# Altium schematic sheet Nucleo.SchDoc
size A3; SheetNumber: 3; SheetTotal: 15
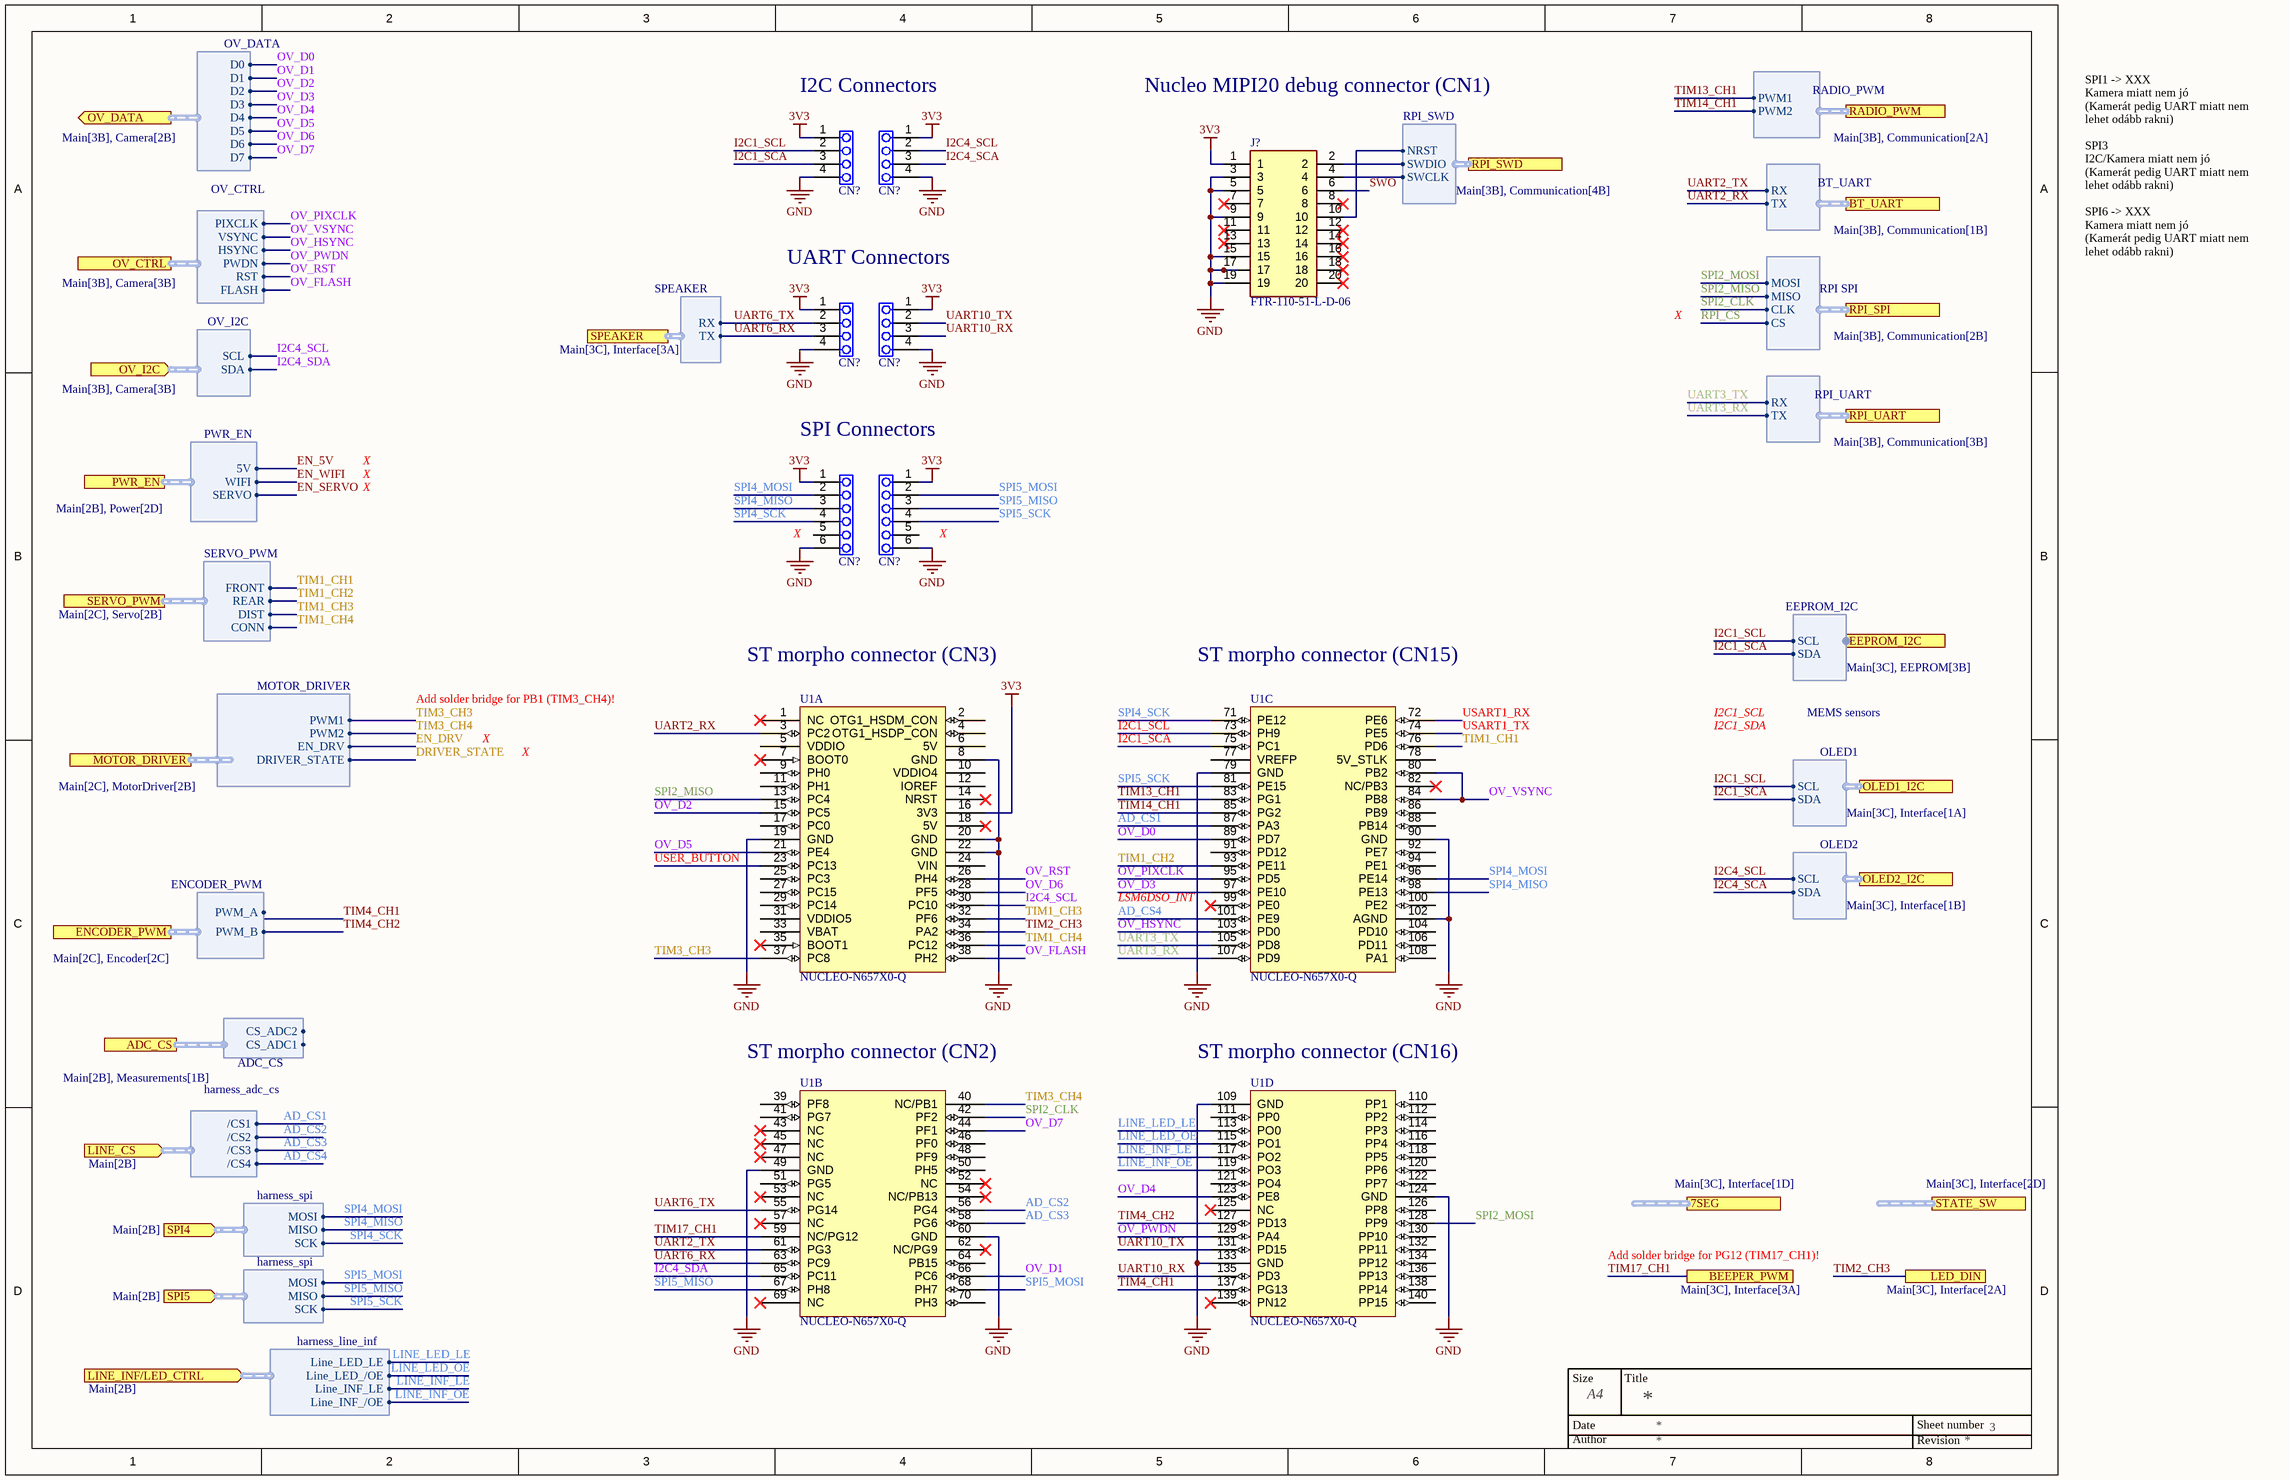
[diagram p0: Nucleo.SchDoc]

## Parts
(Parts that share a designator on the sheet are numbered #1, #2 ... from top to bottom, then left to right.)
CN?#1  Pins 1x3  [PIN-1X4]  (value not drawn)
CN?#2  Pins 1x3  [PIN-1X4]  (value not drawn)
CN?#3  Pins 1x3  [PIN-1X4]  (value not drawn)
CN?#4  Pins 1x3  [PIN-1X4]  (value not drawn)
CN?#5  Pins 1x3  [PIN-1X6]  (value not drawn)
CN?#6  Pins 1x3  [PIN-1X6]  (value not drawn)
J?  FTR-110-51-L-D-06  [HUSSP20W46P254X127_2X10_1270X498X737P]
U1  NUCLEO-N657X0-Q  [FP_NUCLEO-144 - N6]  (parts A,B,C,D of 4)

## Ports
7SEG (see Main[3C], Interface[1D]), ADC_CS (harness ADC_CS, see Main[2B], Measurements[1B]), BEEPER_PWM (see Main[3C], Interface[3A]), BT_UART (harness BT_UART, see Main[3B], Communication[1B]), EEPROM_I2C (harness EEPROM_I2C, see Main[3C], EEPROM[3B]), ENCODER_PWM (harness ENCODER_PWM, see Main[2C], Encoder[2C]), LED_DIN (see Main[3C], Interface[2A]), LINE_CS (in, harness harness_adc_cs, see Main[2B]), LINE_INF/LED_CTRL (in, harness harness_line_inf, see Main[2B]), MOTOR_DRIVER (harness MOTOR_DRIVER, see Main[2C], MotorDriver[2B]), OLED1_I2C (harness OLED1, see Main[3C], Interface[1A]), OLED2_I2C (harness OLED2, see Main[3C], Interface[1B]), OV_CTRL (harness OV_CTRL, see Main[3B], Camera[3B]), OV_DATA (out, harness OV_DATA, see Main[3B], Camera[2B]), OV_I2C (in, harness OV_I2C, see Main[3B], Camera[3B]), PWR_EN (harness PWR_EN, see Main[2B], Power[2D]), RADIO_PWM (harness RADIO_PWM, see Main[3B], Communication[2A]), RPI_SPI (harness RPi SPI, see Main[3B], Communication[2B]), RPI_SWD (harness RPI_SWD, see Main[3B], Communication[4B]), RPI_UART (harness RPI_UART, see Main[3B], Communication[3B]), SERVO_PWM (harness SERVO_PWM, see Main[2C], Servo[2B]), SPEAKER (harness SPEAKER, see Main[3C], Interface[3A]), SPI4 (in, harness harness_spi, see Main[2B]), SPI5 (in, harness harness_spi, see Main[2B]), STATE_SW (see Main[3C], Interface[2D])

## Harnesses
OV_DATA: D0, D1, D2, D3, D4, D5, D6, D7
harness_spi: MOSI, MISO, SCK
harness_line_inf: Line_LED_LE, Line_INF_LE, Line_INF_/OE, Line_LED_/OE
harness_adc_cs: /CS2, /CS1, /CS3, /CS4
OV_CTRL: PIXCLK, VSYNC, HSYNC, RST, PWDN, FLASH
OV_I2C: SCL, SDA
RADIO_PWM: PWM1, PWM2
BT_UART: RX, TX
RPI SPI: CS, MOSI, MISO, CLK
RPI_UART: RX, TX
PWR_EN: 5V, WIFI, SERVO
RPI_SWD: NRST, SWDIO, SWCLK
EEPROM_I2C: SCL, SDA
OLED1: SCL, SDA
OLED2: SCL, SDA
SERVO_PWM: REAR, FRONT, DIST, CONN
SPEAKER: RX, TX
ENCODER_PWM: PWM_A, PWM_B
ADC_CS: CS_ADC2, CS_ADC1
MOTOR_DRIVER: PWM1, PWM2, EN_DRV, DRIVER_STATE

## Nets
3V3: CN?#1.1 CN?#2.1 CN?#3.1 CN?#4.1 CN?#5.1 CN?#6.1 J?.1 U1.16(3V3)
GND: CN?#1.4 CN?#2.4 CN?#3.4 CN?#4.4 CN?#5.6 CN?#6.6 J?.3 J?.5 J?.9 J?.15 J?.17 J?.19 U1.8(GND) U1.19(GND) U1.20(GND) U1.22(GND) U1.49(GND) U1.60(GND) U1.79(GND) U1.90(GND) U1.102(AGND) U1.109(GND) U1.124(GND) U1.133(GND)
AD_CS1: U1.87(PA3) ; port LINE_CS./CS1
AD_CS2: U1.56(PG4) ; port LINE_CS./CS2
AD_CS3: U1.58(PG6) ; port LINE_CS./CS3
AD_CS4: U1.101(PE9) ; port LINE_CS./CS4
DRIVER_STATE: port MOTOR_DRIVER.DRIVER_STATE
EN_5V: port PWR_EN.5V
EN_DRV: port MOTOR_DRIVER.EN_DRV
EN_SERVO: port PWR_EN.SERVO
EN_WIFI: port PWR_EN.WIFI
I2C1_SCA: CN?#1.3 U1.75(PC1) ; port EEPROM_I2C.SDA, port OLED1_I2C.SDA
I2C1_SCL: CN?#1.2 U1.73(PH9) ; port EEPROM_I2C.SCL, port OLED1_I2C.SCL
I2C4_SCA: CN?#2.3 ; port OLED2_I2C.SDA
I2C4_SCL: CN?#2.2 U1.30(PC10) ; port OV_I2C.SCL, port OLED2_I2C.SCL
I2C4_SDA: U1.65(PC11) ; port OV_I2C.SDA
LINE_INF_LE: U1.117(PO2) ; port LINE_INF/LED_CTRL.Line_INF_LE
LINE_INF_OE: U1.119(PO3) ; port LINE_INF/LED_CTRL.Line_INF_/OE
LINE_LED_LE: U1.113(PO0) ; port LINE_INF/LED_CTRL.Line_LED_LE
LINE_LED_OE: U1.115(PO1) ; port LINE_INF/LED_CTRL.Line_LED_/OE
OV_D0: U1.89(PD7) ; port OV_DATA.D0
OV_D1: U1.66(PC6) ; port OV_DATA.D1
OV_D2: U1.15(PC5) ; port OV_DATA.D2
OV_D3: U1.97(PE10) ; port OV_DATA.D3
OV_D4: U1.123(PE8) ; port OV_DATA.D4
OV_D5: U1.21(PE4) ; port OV_DATA.D5
OV_D6: U1.28(PF5) ; port OV_DATA.D6
OV_D7: U1.44(PF1) ; port OV_DATA.D7
OV_FLASH: U1.38(PH2) ; port OV_CTRL.FLASH
OV_HSYNC: U1.103(PD0) ; port OV_CTRL.HSYNC
OV_PIXCLK: U1.95(PD5) ; port OV_CTRL.PIXCLK
OV_PWDN: U1.129(PA4) ; port OV_CTRL.PWDN
OV_RST: U1.26(PH4) ; port OV_CTRL.RST
OV_VSYNC: U1.80(PB2) U1.84(PB8) ; port OV_CTRL.VSYNC
RPI_CS: port RPI_SPI.CS
SPI2_CLK: U1.42(PF2) ; port RPI_SPI.CLK
SPI2_MISO: U1.13(PC4) ; port RPI_SPI.MISO
SPI2_MOSI: U1.128(PP9) ; port RPI_SPI.MOSI
SPI4_MISO: CN?#5.3 U1.98(PE13) ; port SPI4.MISO
SPI4_MOSI: CN?#5.2 U1.96(PE14) ; port SPI4.MOSI
SPI4_SCK: CN?#5.4 U1.71(PE12) ; port SPI4.SCK
SPI5_MISO: CN?#6.3 U1.67(PH8) ; port SPI5.MISO
SPI5_MOSI: CN?#6.2 U1.68(PH7) ; port SPI5.MOSI
SPI5_SCK: CN?#6.4 U1.81(PE15) ; port SPI5.SCK
SWO: J?.6
TIM1_CH1: U1.76(PD6) ; port SERVO_PWM.FRONT
TIM1_CH2: U1.93(PE11) ; port SERVO_PWM.REAR
TIM1_CH3: U1.32(PF6) ; port SERVO_PWM.DIST
TIM1_CH4: U1.36(PC12) ; port SERVO_PWM.CONN
TIM2_CH3: U1.34(PA2) ; port LED_DIN
TIM3_CH3: U1.37(PC8) ; port MOTOR_DRIVER.PWM1
TIM3_CH4: U1.40(NC/PB1) ; port MOTOR_DRIVER.PWM2
TIM4_CH1: U1.137(PG13)
TIM4_CH2: U1.127(PD13) ; port ENCODER_PWM.PWM_B
TIM13_CH1: U1.83(PG1) ; port RADIO_PWM.PWM1
TIM14_CH1: U1.85(PG2) ; port RADIO_PWM.PWM2
TIM17_CH1: U1.59(NC/PG12) ; port BEEPER_PWM
UART2_RX: U1.3(PC2) ; port BT_UART.TX
UART2_TX: U1.61(PG3) ; port BT_UART.RX
UART3_RX: U1.107(PD9) ; port RPI_UART.TX
UART3_TX: U1.105(PD8) ; port RPI_UART.RX
UART6_RX: CN?#3.3 U1.63(PC9) ; port SPEAKER.TX
UART6_TX: CN?#3.2 U1.55(PG14) ; port SPEAKER.RX
UART10_RX: CN?#4.3 U1.135(PD3)
UART10_TX: CN?#4.2 U1.131(PD15)
USART1_RX: U1.72(PE6)
USART1_TX: U1.74(PE5)
USER_BUTTON: U1.23(PC13)
NetJ?_2: J?.2 ; port RPI_SWD.SWDIO
NetJ?_4: J?.4 ; port RPI_SWD.SWCLK
NetJ?_10: J?.10 ; port RPI_SWD.NRST

Not connected (* = marked no-connect by the designer): CN?#5 5; CN?#6 5; J? 7* 8* 11* 12* 13* 14* 16* 18* 20*; U1 1(NC)* 2(OTG1_HSDM_CON) 4(OTG1_HSDP_CON) 5(VDDIO) 6(5V) 7(BOOT0)* 9(PH0) 10(VDDIO4) 11(PH1) 12(IOREF) 14(NRST)* 17(PC0) 18(5V)* 24(VIN) 25(PC3) 27(PC15) 29(PC14) 31(VDDIO5) 33(VBAT) 35(BOOT1)* 39(PF8) 41(PG7) 43(NC)* 45(NC)* 46(PF0) 47(NC)* 48(PF9) 50(PH5) 51(PG5) 52(NC)* 53(NC)* 54(NC/PB13)* 57(NC)* 62(NC/PG9)* 64(PB15) 69(NC)* 70(PH3) 77(VREFP) 78(5V_STLK) 82(NC/PB3)* 86(PB9) 88(PB14) 91(PD12) 92(PE7) 94(PE1) 99(PE0)* 100(PE2) 104(PD10) 106(PD11) 108(PA1) 110(PP1) 111(PP0) 112(PP2) 114(PP3) 116(PP4) 118(PP5) 120(PP6) 121(PO4) 122(PP7) 125(NC)* 126(PP8) 130(PP10) 132(PP11) 134(PP12) 136(PP13) 138(PP14) 139(PN12)* 140(PP15)

## Notes on the sheet
- (near CN?#1) I2C Connectors
- Nucleo MIPI20 debug connector (CN1)
- (near CN?#3) UART Connectors
- SPI1 -> XXX
  Kamera miatt nem jó
  (Kamerát pedig UART miatt nem lehet odább rakni)
  SPI3
  I2C/Kamera miatt nem jó
  (Kamerát pedig UART miatt nem lehet odább rakni)
  SPI6 -> XXX
  Kamera miatt nem jó
  (Kamerát pedig UART miatt nem lehet odább rakni)
- X
- (near CN?#6) SPI Connectors
- (near CN?#5) X
- (near CN?#6) X
- ST morpho connector (CN3)
- ST morpho connector (CN15)
- I2C1_SCL
- I2C1_SDA
- MEMS sensors
- LSM6DSO_INT
- (near U1) ST morpho connector (CN2)
- (near U1) ST morpho connector (CN16)
- Labels drawn without touching a wire or pin: Add solder bridge for PB1 (TIM3_CH4)!, Add solder bridge for PG12 (TIM17_CH1)!
- Size
- Date
- A4
- Title
- Sheet number
- Author
- Revision

## Library data of the parts
CN?#1-CN?#4 = Pin-1x4: 2.54mm; Part Class: Connector; Order Code: 855-M50-3530342; CompType: M50-3530342; Distributor: Mouser; Package: SMD 1.27mm
CN?#5 CN?#6 = Pin-1x6: 2.54mm; Part Class: Connector; Order Code: 855-M50-3530342; CompType: M50-3530342; Distributor: Mouser; Package: SMD 1.27mm
J? = FTR-110-51-L-D-06: Connector; Manufacturer_Name: SAMTEC; Datasheet Link: http://suddendocs.samtec.com/catalog_english/ftr_smt.pdf; Manufacturer_Part_Number: FTR-110-51-L-D-06; Mouser Part Number: 200-FTR11051LD06; Mouser Price/Stock: https://www.mouser.co.uk/ProductDetail/Samtec/FTR-110-51-L-D-06?qs=PB6%2FjmICvI0RsXPabwmjvw%3D%3D; Arrow Part Number: FTR-110-51-L-D-06; Arrow Price/Stock: https://www.arrow.com/en/products/ftr-110-51-l-d-06/samtec?region=nac
U1 = NUCLEO-N657X0-Q: Reference: NUCLEO; Supplier: Tanszék; Name: NUCLEO-N657X0-Q